# EAGLE schematic mixer2 (EAGLE 7.3.0)
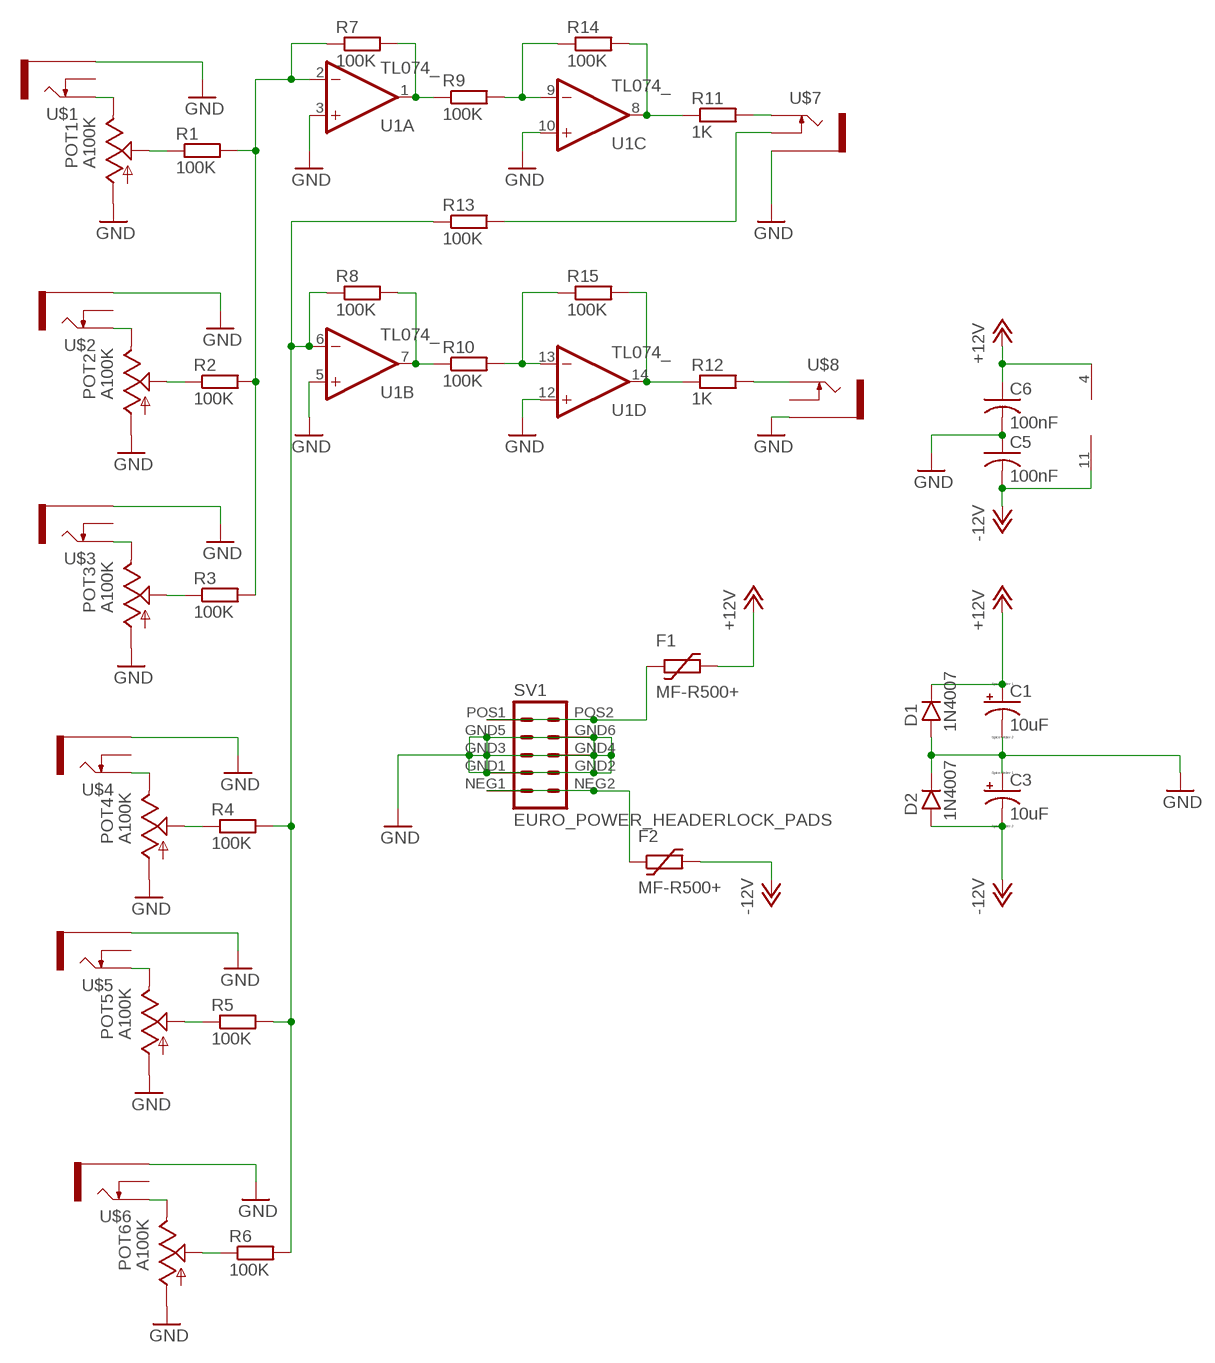
[diagram p0: schematic, sheet 1]

## Parts
C1  10uF  CPOL-USE2.5-7  [E2,5-7]
C3  10uF  CPOL-USE2.5-7  [E2,5-7]
C5  100nF  C-US075-032X103  [C075-032X103]
C6  100nF  C-US075-032X103  [C075-032X103]
D1  1N4007  1N400X.3  [DO41-3]
D2  1N4007  1N400X.3  [DO41-3]
F1  MF-R500+  [BOURNS-MF-R]
F2  MF-R500+  [BOURNS-MF-R]
POT1  A100K  9MM_SNAP-IN_POT_  [9MM_SNAP-IN_POT]
POT2  A100K  9MM_SNAP-IN_POT_  [9MM_SNAP-IN_POT]
POT3  A100K  9MM_SNAP-IN_POT_  [9MM_SNAP-IN_POT]
POT4  A100K  9MM_SNAP-IN_POT_  [9MM_SNAP-IN_POT]
POT5  A100K  9MM_SNAP-IN_POT_  [9MM_SNAP-IN_POT]
POT6  A100K  9MM_SNAP-IN_POT_  [9MM_SNAP-IN_POT]
R1  100K  RESISTOR7MM  [7MM_RESISTOR]
R2  100K  RESISTOR7MM  [7MM_RESISTOR]
R3  100K  RESISTOR7MM  [7MM_RESISTOR]
R4  100K  RESISTOR7MM  [7MM_RESISTOR]
R5  100K  RESISTOR7MM  [7MM_RESISTOR]
R6  100K  RESISTOR7MM  [7MM_RESISTOR]
R7  100K  RESISTOR7MM  [7MM_RESISTOR]
R8  100K  RESISTOR7MM  [7MM_RESISTOR]
R9  100K  RESISTOR7MM  [7MM_RESISTOR]
R10  100K  RESISTOR7MM  [7MM_RESISTOR]
R11  1K  RESISTOR7MM  [7MM_RESISTOR]
R12  1K  RESISTOR7MM  [7MM_RESISTOR]
R13  100K  RESISTOR7MM  [7MM_RESISTOR]
R14  100K  RESISTOR7MM  [7MM_RESISTOR]
R15  100K  RESISTOR7MM  [7MM_RESISTOR]
SV1  EURO_POWER_HEADERLOCK_PADS  [EURO_PWR_HEADER_LOCK]
U1  TL074_  [DIL14]
U$1  THONKICONNNEW  [WQP-PJ301M-12_JACK]
U$2  THONKICONNNEW  [WQP-PJ301M-12_JACK]
U$3  THONKICONNNEW  [WQP-PJ301M-12_JACK]
U$4  THONKICONNNEW  [WQP-PJ301M-12_JACK]
U$5  THONKICONNNEW  [WQP-PJ301M-12_JACK]
U$6  THONKICONNNEW  [WQP-PJ301M-12_JACK]
U$7  THONKICONNNEW  [WQP-PJ301M-12_JACK]
U$8  THONKICONNNEW  [WQP-PJ301M-12_JACK]

## Nets
+12V: C1.+ C6.1 D1.C F1.P$2 U1.4(P:V+)
-12V: C3.- C5.2 D2.A F2.P$2 U1.11(P:V-)
GND: C1.- C3.+ C5.1 C6.2 D1.A D2.C POT1.1(A) POT2.1(A) POT3.1(A) POT4.1(A) POT5.1(A) POT6.1(A) SV1.GND1 SV1.GND2 SV1.GND3 SV1.GND4 SV1.GND5 SV1.GND6 U1.3(A:+IN) U1.5(B:+IN) U1.10(C:+IN) U1.12(D:+IN) U$1.P$3_SLEEVE(SLEEVE) U$2.P$3_SLEEVE(SLEEVE) U$3.P$3_SLEEVE(SLEEVE) U$4.P$3_SLEEVE(SLEEVE) U$5.P$3_SLEEVE(SLEEVE) U$6.P$3_SLEEVE(SLEEVE) U$7.P$3_SLEEVE(SLEEVE) U$8.P$3_SLEEVE(SLEEVE)
N$1: POT2.3(E) U$2.P$1_TIP(TIP)
N$2: POT2.2(S) R2.1
N$3: POT1.3(E) U$1.P$1_TIP(TIP)
N$4: POT1.2(S) R1.1
N$5: POT3.3(E) U$3.P$1_TIP(TIP)
N$6: POT3.2(S) R3.1
N$7: POT4.3(E) U$4.P$1_TIP(TIP)
N$8: POT4.2(S) R4.1
N$9: POT5.3(E) U$5.P$1_TIP(TIP)
N$10: POT5.2(S) R5.1
N$11: POT6.3(E) U$6.P$1_TIP(TIP)
N$12: POT6.2(S) R6.1
N$13: R1.2 R2.2 R3.2 R7.1 U1.2(A:-IN)
N$15: R8.2 R10.1 U1.7(B:OUT)
N$17: R9.2 R14.1 U1.9(C:-IN)
N$18: R11.2 U$7.P$1_TIP(TIP)
N$22: R12.1 R15.2 U1.14(D:OUT)
N$23: R10.2 R15.1 U1.13(D:-IN)
N$24: R4.2 R5.2 R6.2 R8.1 R13.1 U1.6(B:-IN)
N$25: R11.1 R14.2 U1.8(C:OUT)
N$26: R13.2 U$7.P$2_SWITCH(SWITCH)
N$27: R12.2 U$8.P$1_TIP(TIP)
N$28: R7.2 R9.1 U1.1(A:OUT)
N$31: F2.P$1 SV1.NEG1 SV1.NEG2
N$32: F1.P$1 SV1.POS1 SV1.POS2
Unconnected: U$1.P$2_SWITCH(SWITCH) U$2.P$2_SWITCH(SWITCH) U$3.P$2_SWITCH(SWITCH) U$4.P$2_SWITCH(SWITCH) U$5.P$2_SWITCH(SWITCH) U$6.P$2_SWITCH(SWITCH) U$8.P$2_SWITCH(SWITCH)

## Library data of the parts
C1 C3 = resistor:CPOL-US: POLARIZED CAPACITOR, American symbol
C5 C6 = resistor:C-US: CAPACITOR, American symbol
D1 D2 = gm-diodes:1N400X: Rectifier Diodes often used in power supply to prevent damage from reverse polarization
F1 F2 = ptc-littlefuse:MF-R500+: http://www.farnell.com/datasheets/1817521.pdf
POT1-POT6 = MusicThingModular:9MM_SNAP-IN_POT: 9mm vertical snap-in pot, Alpha / Panasonic style
R1-R15 = MusicThingModular:RESISTOR: Standard resistor, various versions
SV1 = MusicThingModular:EURO_POWER_HEADER: Power Header 10 pin power header for Eurorack Power Supplies Variants with fatter pads for easier soldering, and the LOCK variant which has 5mil offset pins to hold the component in place before soldering
U1 = MusicThingModular:TL074: Generic Quad Op Amp
U$1-U$8 = MusicThingModular:THONKICONN: 3.5mm socket for Eurorack modular synths